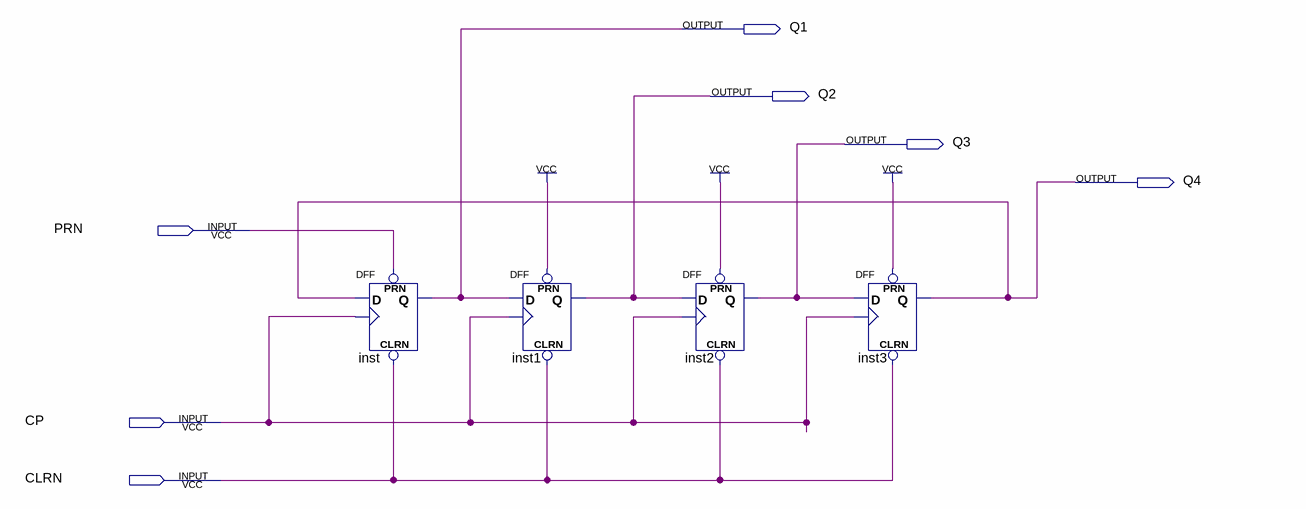
[diagram p0: schematic sheet]
// Quartus schematic test3.bdf as structural Verilog: 4 symbols, 7 pins
module test3 (
  input  PRN,
  input  CP,
  input  CLRN,
  output Q1,
  output Q2,
  output Q3,
  output Q4
);

  DFF inst (.CLRN(CLRN), .CLK(CP), .D(Q4), .PRN(PRN), .Q(Q1));
  DFF inst1 (.CLRN(CLRN), .CLK(CP), .D(Q1), .PRN(1'b1), .Q(Q2));
  DFF inst2 (.CLRN(CLRN), .CLK(CP), .D(Q2), .PRN(1'b1), .Q(Q3));
  DFF inst3 (.CLRN(CLRN), .CLK(CP), .D(Q3), .PRN(1'b1), .Q(Q4));
endmodule
